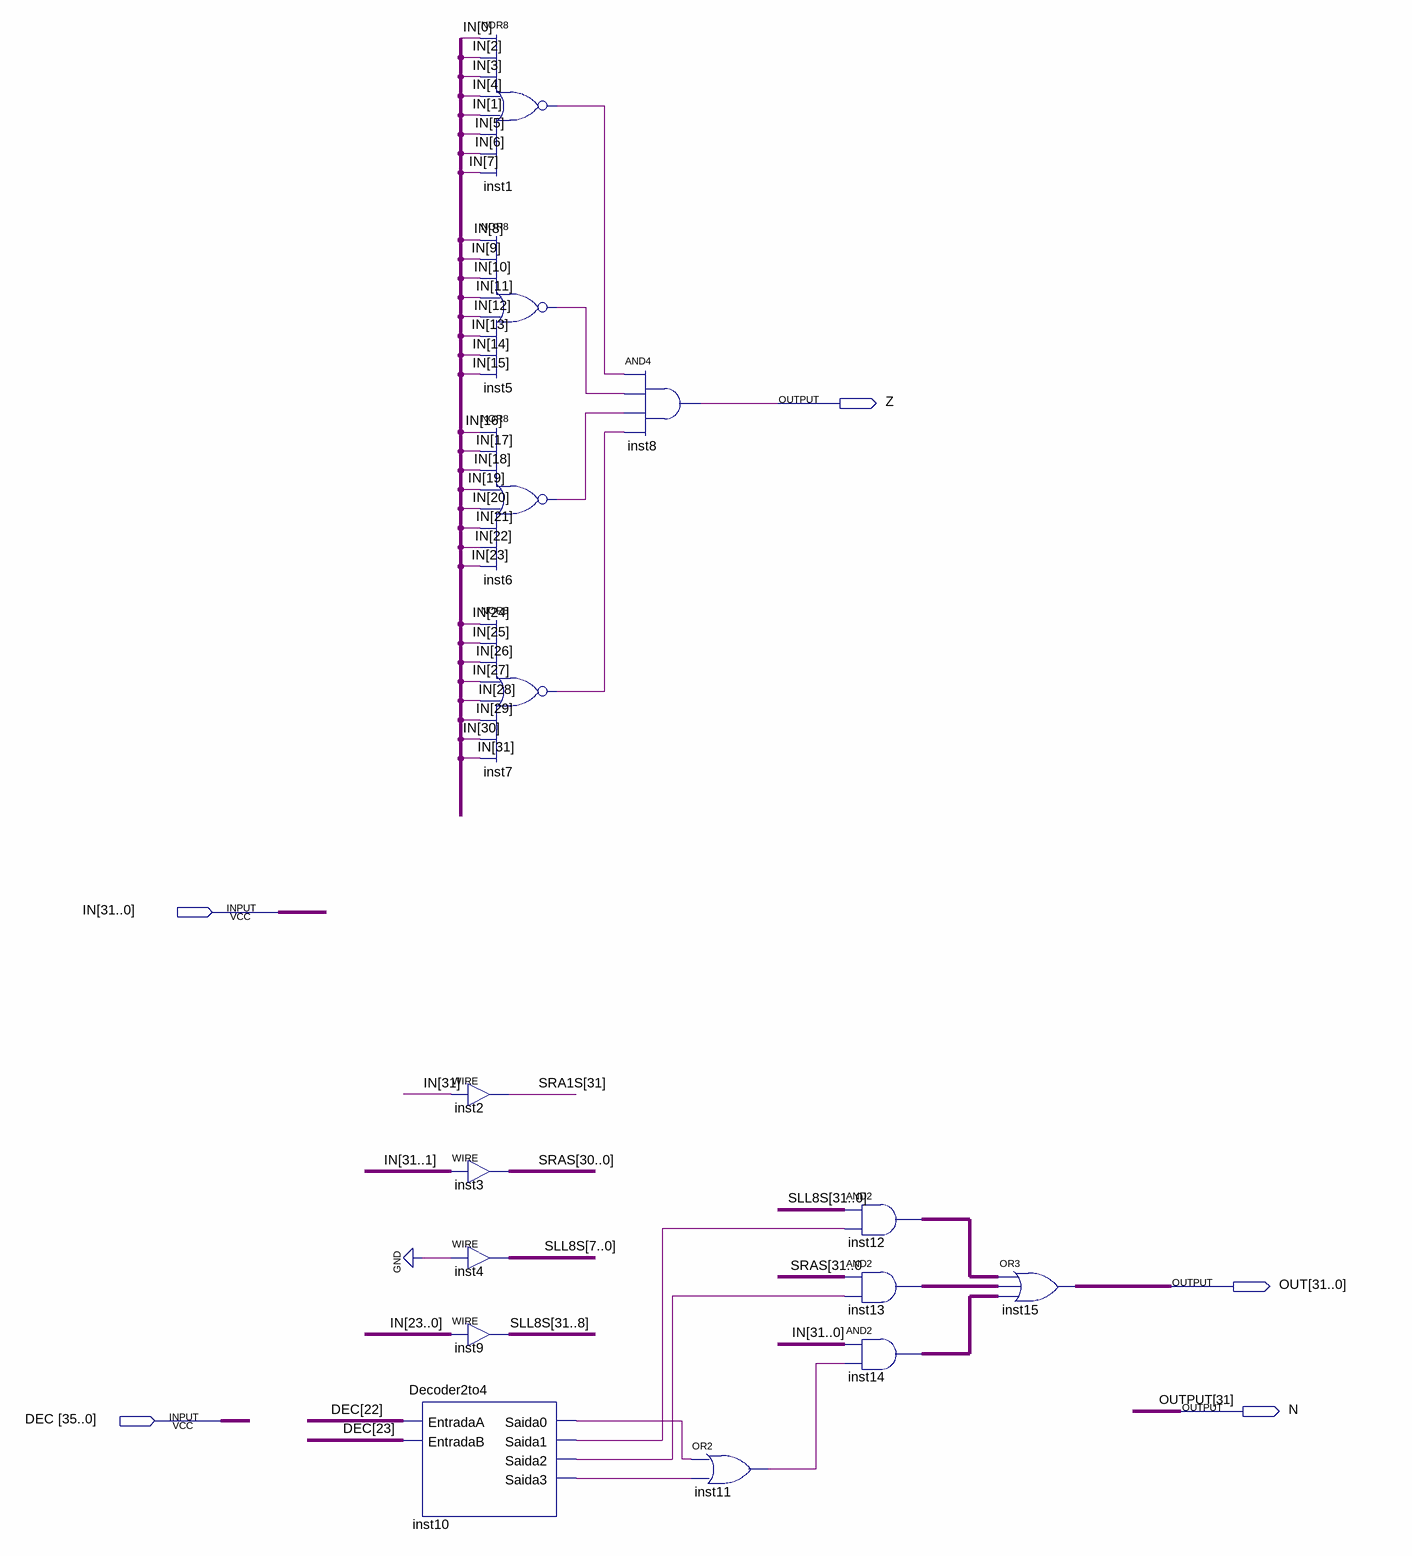
[diagram p0: schematic sheet]
// Quartus schematic Shifter_32Bits.bdf as structural Verilog: 15 symbols, 5 pins
module Shifter_32Bits (
  input  [31:0] IN,
  input  [35:0] DEC,
  output Z,
  output [31:0] OUT,
  output N
);

  wire inst1_out, inst5_out, inst6_out, inst7_out, inst10_saida0, inst10_saida1, inst10_saida2,
       inst10_saida3, inst11_out, \SRAS[31..0 ;
  wire [30:0] SRAS;
  wire [31:0] inst12_out, inst13_out, inst14_out, SLL8S;
  wire [31:31] SRA1S;

  Decoder2to4 inst10 (
    .EntradaA(DEC[22]), .EntradaB(DEC[23]), .Saida0(inst10_saida0), .Saida1(inst10_saida1),
    .Saida2(inst10_saida2), .Saida3(inst10_saida3));
  nor inst1 (inst1_out, IN[0], IN[2], IN[3], IN[4], IN[1], IN[5], IN[6], IN[7]);
  nor inst5 (inst5_out, IN[8], IN[9], IN[10], IN[11], IN[12], IN[13], IN[14], IN[15]);
  nor inst6 (inst6_out, IN[16], IN[17], IN[18], IN[19], IN[20], IN[21], IN[22], IN[23]);
  nor inst7 (inst7_out, IN[24], IN[25], IN[26], IN[27], IN[28], IN[29], IN[30], IN[31]);
  assign SRA1S[31] = IN[31];  // WIRE inst2
  assign SRAS = IN[31:1];  // WIRE inst3
  assign SLL8S[7:0] = {8{1'b0}};  // WIRE inst4
  assign SLL8S[31:8] = IN[23:0];  // WIRE inst9
  and inst8 (Z, inst1_out, inst5_out, inst6_out, inst7_out);
  or inst11 (inst11_out, inst10_saida0, inst10_saida3);
  assign inst12_out = SLL8S & {32{inst10_saida1}};  // AND2 inst12, 32 bits wide
  assign inst13_out = {32{\SRAS[31..0 }} & {32{inst10_saida2}};  // AND2 inst13, 32 bits wide
  assign inst14_out = IN & {32{inst11_out}};  // AND2 inst14, 32 bits wide
  assign OUT = inst12_out | inst13_out | inst14_out;  // OR3 inst15, 32 bits wide

  // Other names for the same wires on the sheet: OUTPUT[31] = N
endmodule
